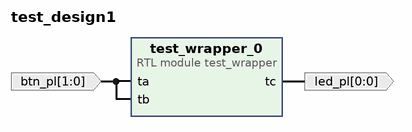
[diagram p0: block diagram of the top level]
# Vivado block design test_design1, xc7z010iclg400-1L, Vivado 2024.2
create_bd_design test_design1

create_bd_port -dir O -from 0 -to 0 led_pl
create_bd_port -dir I -from 1 -to 0 btn_pl

create_bd_cell -type module -reference test_wrapper test_wrapper_0

# ---- connections ----

connect_bd_net [get_bd_ports btn_pl] [get_bd_pins test_wrapper_0/ta] [get_bd_pins test_wrapper_0/tb]
connect_bd_net [get_bd_pins test_wrapper_0/tc] [get_bd_ports led_pl]

validate_bd_design
save_bd_design
